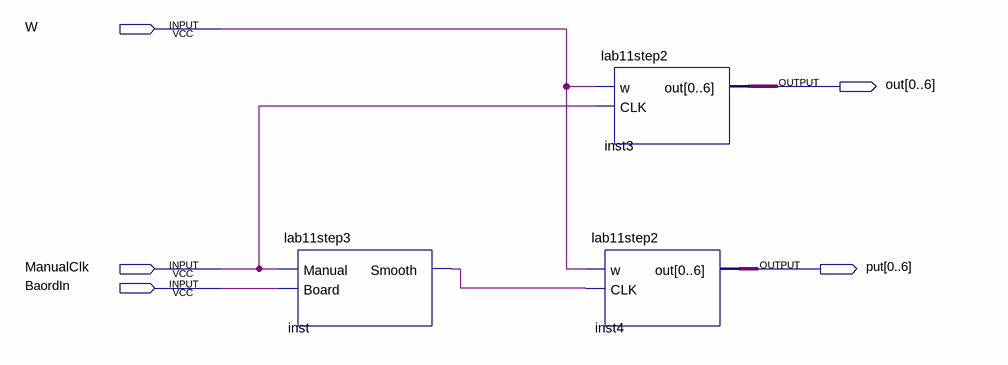
[diagram p0: schematic sheet]
// Quartus schematic lab11step4.bdf as structural Verilog: 3 symbols, 5 pins
module lab11step4 (
  input  W,
  input  ManualClk,
  input  BaordIn,
  output [0:6] out,
  output [0:6] put
);

  wire inst_smooth;

  lab11step3 inst (.Manual(ManualClk), .Board(BaordIn), .Smooth(inst_smooth));
  lab11step2 inst4 (.w(W), .CLK(inst_smooth), .out(put));
  lab11step2 inst3 (.w(W), .CLK(ManualClk), .out(out));
endmodule
